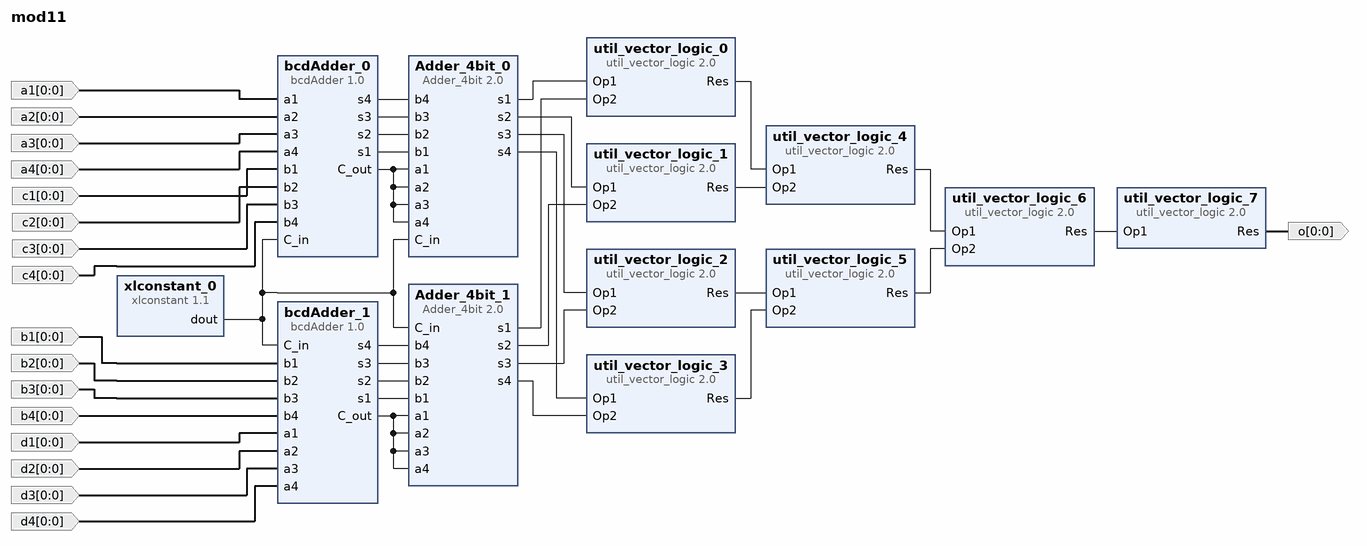
[diagram p0: block diagram of the top level]
# Vivado block design mod11, xc7k325tffg900-2, Vivado 2019.1
create_bd_design mod11

create_bd_port -dir I -from 0 -to 0 a1
create_bd_port -dir I -from 0 -to 0 a2
create_bd_port -dir I -from 0 -to 0 a3
create_bd_port -dir I -from 0 -to 0 a4
create_bd_port -dir I -from 0 -to 0 b1
create_bd_port -dir I -from 0 -to 0 b2
create_bd_port -dir I -from 0 -to 0 b3
create_bd_port -dir I -from 0 -to 0 b4
create_bd_port -dir I -from 0 -to 0 c1
create_bd_port -dir I -from 0 -to 0 c2
create_bd_port -dir I -from 0 -to 0 c3
create_bd_port -dir I -from 0 -to 0 c4
create_bd_port -dir I -from 0 -to 0 d1
create_bd_port -dir I -from 0 -to 0 d2
create_bd_port -dir I -from 0 -to 0 d3
create_bd_port -dir I -from 0 -to 0 d4
create_bd_port -dir O -from 0 -to 0 o

create_bd_cell -type ip -vlnv xilinx.com:user:bcdAdder:1.0 bcdAdder_0
create_bd_cell -type ip -vlnv xilinx.com:user:bcdAdder:1.0 bcdAdder_1
create_bd_cell -type ip -vlnv xilinx.com:user:Adder_4bit:2.0 Adder_4bit_0
create_bd_cell -type ip -vlnv xilinx.com:user:Adder_4bit:2.0 Adder_4bit_1
create_bd_cell -type ip -vlnv xilinx.com:ip:xlconstant:1.1 xlconstant_0
set_property -dict {CONFIG.CONST_VAL 0} [get_bd_cells xlconstant_0]
create_bd_cell -type ip -vlnv xilinx.com:ip:util_vector_logic:2.0 util_vector_logic_0
set_property -dict {CONFIG.C_OPERATION xor CONFIG.C_SIZE 1} [get_bd_cells util_vector_logic_0]
create_bd_cell -type ip -vlnv xilinx.com:ip:util_vector_logic:2.0 util_vector_logic_1
set_property -dict {CONFIG.C_OPERATION xor CONFIG.C_SIZE 1} [get_bd_cells util_vector_logic_1]
create_bd_cell -type ip -vlnv xilinx.com:ip:util_vector_logic:2.0 util_vector_logic_2
set_property -dict {CONFIG.C_OPERATION xor CONFIG.C_SIZE 1} [get_bd_cells util_vector_logic_2]
create_bd_cell -type ip -vlnv xilinx.com:ip:util_vector_logic:2.0 util_vector_logic_3
set_property -dict {CONFIG.C_OPERATION xor CONFIG.C_SIZE 1} [get_bd_cells util_vector_logic_3]
create_bd_cell -type ip -vlnv xilinx.com:ip:util_vector_logic:2.0 util_vector_logic_4
set_property -dict {CONFIG.C_OPERATION or CONFIG.C_SIZE 1} [get_bd_cells util_vector_logic_4]
create_bd_cell -type ip -vlnv xilinx.com:ip:util_vector_logic:2.0 util_vector_logic_5
set_property -dict {CONFIG.C_OPERATION or CONFIG.C_SIZE 1} [get_bd_cells util_vector_logic_5]
create_bd_cell -type ip -vlnv xilinx.com:ip:util_vector_logic:2.0 util_vector_logic_6
set_property -dict {CONFIG.C_OPERATION or CONFIG.C_SIZE 1} [get_bd_cells util_vector_logic_6]
create_bd_cell -type ip -vlnv xilinx.com:ip:util_vector_logic:2.0 util_vector_logic_7
set_property -dict {CONFIG.C_OPERATION not CONFIG.C_SIZE 1} [get_bd_cells util_vector_logic_7]

# ---- connections ----

connect_bd_net -net a1_1 [get_bd_ports a1] [get_bd_pins bcdAdder_0/a1]
connect_bd_net -net a2_1 [get_bd_ports a2] [get_bd_pins bcdAdder_0/a2]
connect_bd_net -net a3_1 [get_bd_ports a3] [get_bd_pins bcdAdder_0/a3]
connect_bd_net -net a4_1 [get_bd_ports a4] [get_bd_pins bcdAdder_0/a4]
connect_bd_net -net b1_1 [get_bd_ports b1] [get_bd_pins bcdAdder_1/b1]
connect_bd_net -net b2_1 [get_bd_ports b2] [get_bd_pins bcdAdder_1/b2]
connect_bd_net -net b3_1 [get_bd_ports b3] [get_bd_pins bcdAdder_1/b3]
connect_bd_net -net b4_1 [get_bd_ports b4] [get_bd_pins bcdAdder_1/b4]
connect_bd_net -net c1_1 [get_bd_ports c1] [get_bd_pins bcdAdder_0/b1]
connect_bd_net -net c2_1 [get_bd_ports c2] [get_bd_pins bcdAdder_0/b2]
connect_bd_net -net c3_1 [get_bd_ports c3] [get_bd_pins bcdAdder_0/b3]
connect_bd_net -net c4_1 [get_bd_ports c4] [get_bd_pins bcdAdder_0/b4]
connect_bd_net -net d1_1 [get_bd_ports d1] [get_bd_pins bcdAdder_1/a1]
connect_bd_net -net d2_1 [get_bd_ports d2] [get_bd_pins bcdAdder_1/a2]
connect_bd_net -net d3_1 [get_bd_ports d3] [get_bd_pins bcdAdder_1/a3]
connect_bd_net -net d4_1 [get_bd_ports d4] [get_bd_pins bcdAdder_1/a4]
connect_bd_net [get_bd_pins bcdAdder_0/s4] [get_bd_pins Adder_4bit_0/b4]
connect_bd_net [get_bd_pins bcdAdder_0/s3] [get_bd_pins Adder_4bit_0/b3]
connect_bd_net [get_bd_pins bcdAdder_0/s2] [get_bd_pins Adder_4bit_0/b2]
connect_bd_net [get_bd_pins bcdAdder_0/s1] [get_bd_pins Adder_4bit_0/b1]
connect_bd_net [get_bd_pins bcdAdder_0/C_out] \
  [get_bd_pins Adder_4bit_0/a4] [get_bd_pins Adder_4bit_0/a3] [get_bd_pins Adder_4bit_0/a2] [get_bd_pins Adder_4bit_0/a1]
connect_bd_net [get_bd_pins bcdAdder_1/s4] [get_bd_pins Adder_4bit_1/b4]
connect_bd_net [get_bd_pins bcdAdder_1/s3] [get_bd_pins Adder_4bit_1/b3]
connect_bd_net [get_bd_pins bcdAdder_1/s2] [get_bd_pins Adder_4bit_1/b2]
connect_bd_net [get_bd_pins bcdAdder_1/s1] [get_bd_pins Adder_4bit_1/b1]
connect_bd_net [get_bd_pins bcdAdder_1/C_out] \
  [get_bd_pins Adder_4bit_1/a4] [get_bd_pins Adder_4bit_1/a3] [get_bd_pins Adder_4bit_1/a2] [get_bd_pins Adder_4bit_1/a1]
connect_bd_net [get_bd_pins xlconstant_0/dout] \
  [get_bd_pins bcdAdder_0/C_in] [get_bd_pins bcdAdder_1/C_in] [get_bd_pins Adder_4bit_0/C_in] [get_bd_pins Adder_4bit_1/C_in]
connect_bd_net [get_bd_pins Adder_4bit_0/s1] [get_bd_pins util_vector_logic_0/Op1]
connect_bd_net [get_bd_pins Adder_4bit_1/s1] [get_bd_pins util_vector_logic_0/Op2]
connect_bd_net [get_bd_pins Adder_4bit_0/s2] [get_bd_pins util_vector_logic_1/Op1]
connect_bd_net [get_bd_pins Adder_4bit_1/s2] [get_bd_pins util_vector_logic_1/Op2]
connect_bd_net [get_bd_pins Adder_4bit_0/s3] [get_bd_pins util_vector_logic_2/Op1]
connect_bd_net [get_bd_pins Adder_4bit_1/s3] [get_bd_pins util_vector_logic_2/Op2]
connect_bd_net [get_bd_pins Adder_4bit_1/s4] [get_bd_pins util_vector_logic_3/Op2]
connect_bd_net [get_bd_pins Adder_4bit_0/s4] [get_bd_pins util_vector_logic_3/Op1]
connect_bd_net [get_bd_pins util_vector_logic_0/Res] [get_bd_pins util_vector_logic_4/Op1]
connect_bd_net [get_bd_pins util_vector_logic_1/Res] [get_bd_pins util_vector_logic_4/Op2]
connect_bd_net [get_bd_pins util_vector_logic_2/Res] [get_bd_pins util_vector_logic_5/Op1]
connect_bd_net [get_bd_pins util_vector_logic_3/Res] [get_bd_pins util_vector_logic_5/Op2]
connect_bd_net [get_bd_pins util_vector_logic_4/Res] [get_bd_pins util_vector_logic_6/Op1]
connect_bd_net [get_bd_pins util_vector_logic_5/Res] [get_bd_pins util_vector_logic_6/Op2]
connect_bd_net [get_bd_pins util_vector_logic_6/Res] [get_bd_pins util_vector_logic_7/Op1]
connect_bd_net [get_bd_pins util_vector_logic_7/Res] [get_bd_ports o]

validate_bd_design
save_bd_design
